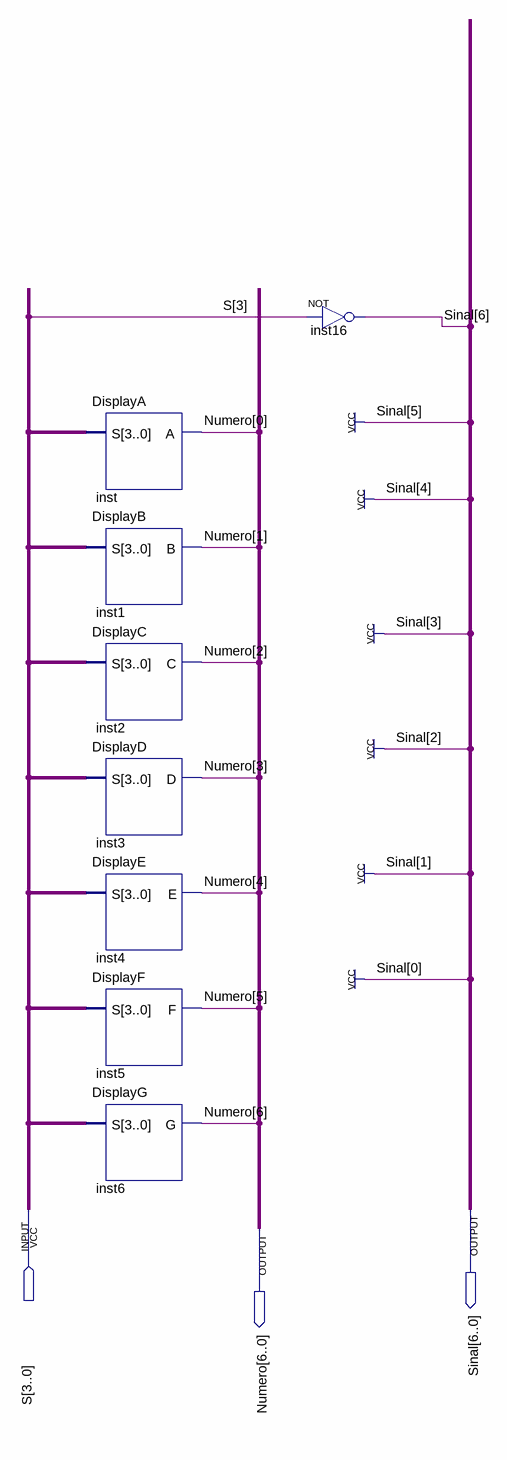
[diagram p0: schematic sheet]
// Quartus schematic DisplayULA.bdf as structural Verilog: 8 symbols, 3 pins
module DisplayULA (
  input  [3:0] S,
  output [6:0] Sinal,
  output [6:0] Numero
);

  DisplayA inst (.S(S), .A(Numero[0]));
  DisplayB inst1 (.S(S), .B(Numero[1]));
  DisplayC inst2 (.S(S), .C(Numero[2]));
  DisplayD inst3 (.S(S), .D(Numero[3]));
  DisplayE inst4 (.S(S), .E(Numero[4]));
  DisplayF inst5 (.S(S), .F(Numero[5]));
  DisplayG inst6 (.S(S), .G(Numero[6]));
  not inst16 (Sinal[6], S[3]);

  assign Sinal[5:0] = {6{1'b1}};
endmodule
